# Altium schematic sheet 4_Configuration.SchDoc: FPGA Configuration
size Legal; Author: Praveen Perera; DrawnBy: Praveen Perera; Engineer: Praveen Perera; Revision: 0; SheetNumber: 4; SheetTotal: 9; Time: 12/26/2025
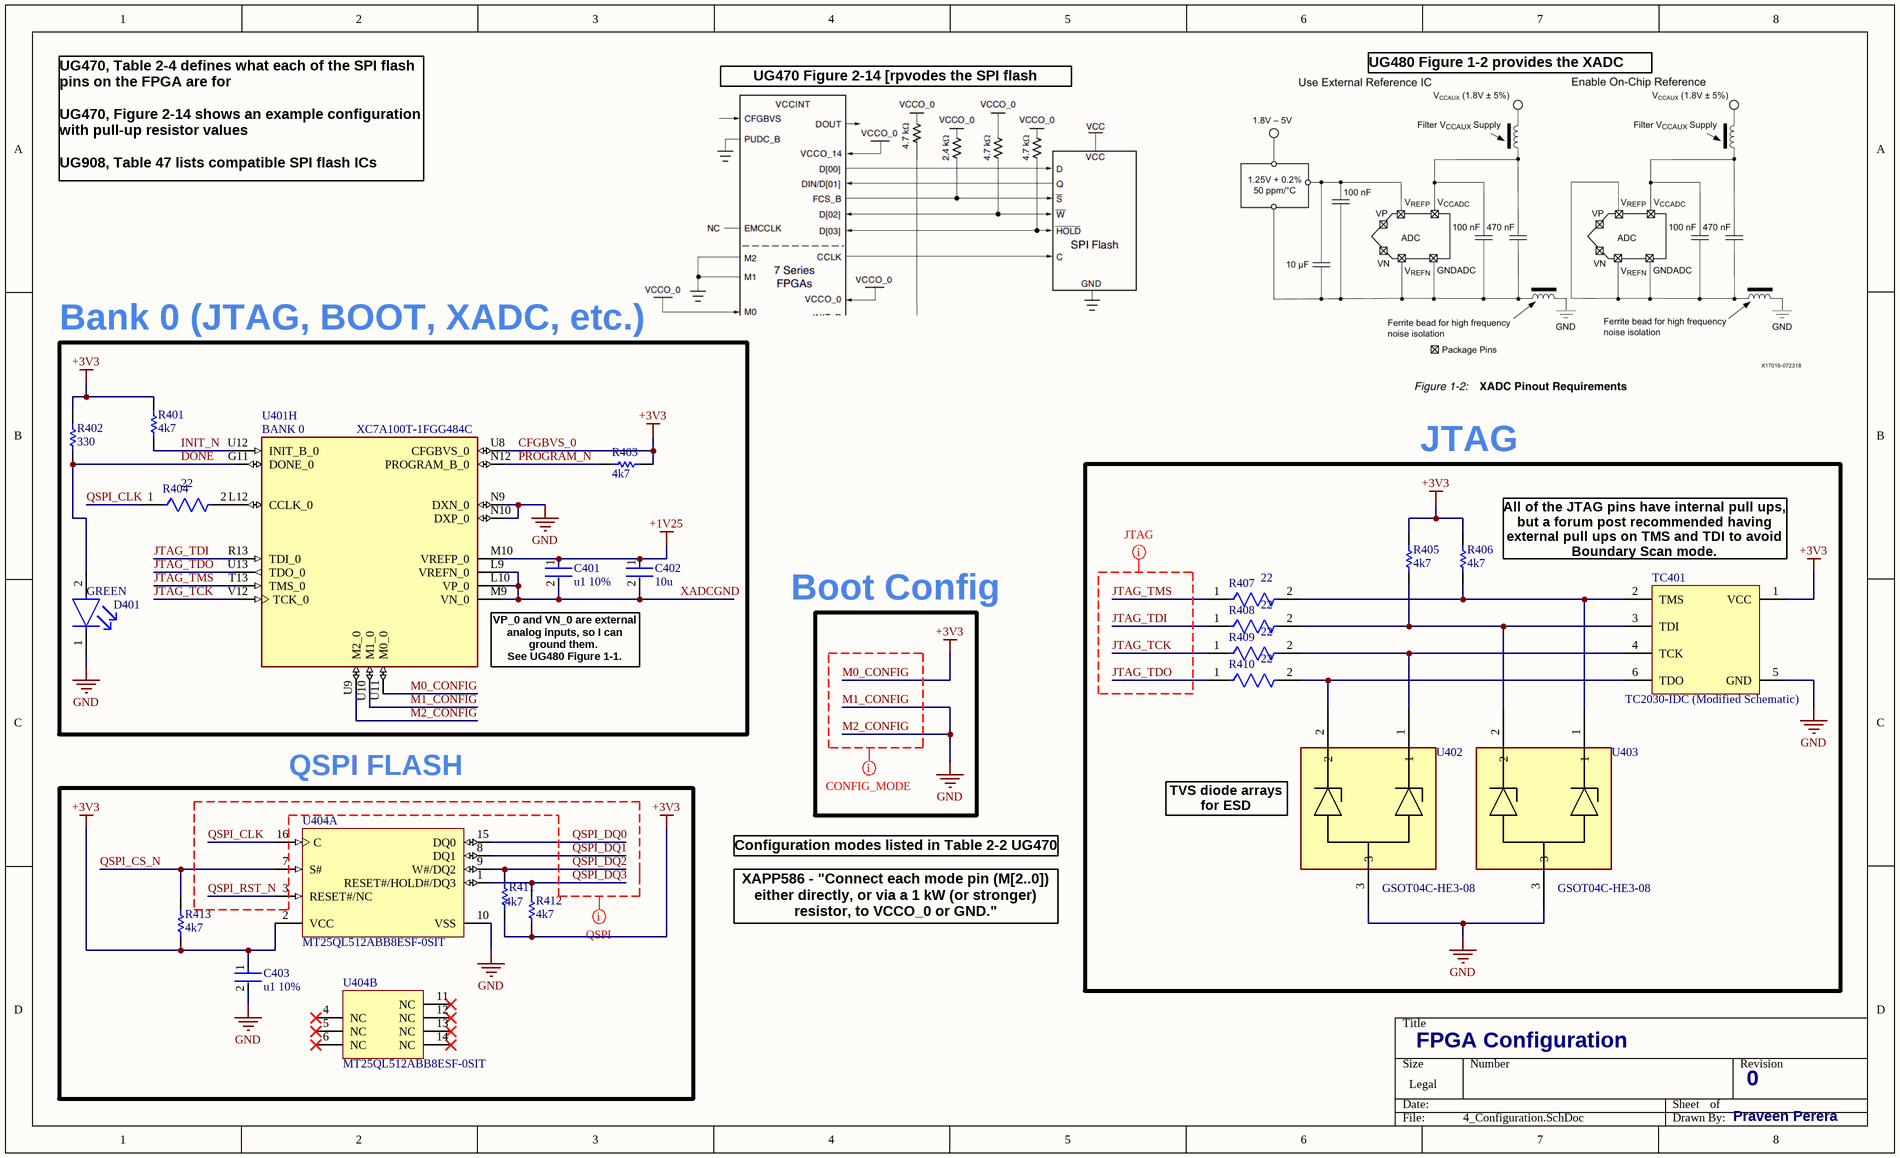
[diagram p0: 4_Configuration.SchDoc]

## Parts
C401  u1 10%  [FP-CL891-IPC_C]
C402  10u  [FP-CL05A106MP5NUNC-MFG]
C403  u1 10%  [FP-CL891-IPC_C]
D401  GREEN  [FP-SML-D12-MFG]
R401  4k7  [RESC0603X28X15NL05T05]
R402  330  [RESC0201(0603)_M]
R403  4k7  [RESC0603X28X15NL05T05]
R404  22  [FP-RMCF0201-IPC_C]
R405  4k7  [RESC0603X28X15NL05T05]
R406  4k7  [RESC0603X28X15NL05T05]
R407  22  [FP-RMCF0201-IPC_C]
R408  22  [FP-RMCF0201-IPC_C]
R409  22  [FP-RMCF0201-IPC_C]
R410  22  [FP-RMCF0201-IPC_C]
R411  4k7  [RESC0603X28X15NL05T05]
R412  4k7  [RESC0603X28X15NL05T05]
R413  4k7  [RESC0603X28X15NL05T05]
TC401  TC2030-IDC (Modified Schematic)  [*TC2030-IDC]
U401  XC7A100T-1FGG484C  [BGA484C100P22X22_2300X2300X260N]  (part H of 14)
U402  GSOT04C-HE3-08  [SOT_C-HE3-08_VIS]
U403  GSOT04C-HE3-08  [SOT_C-HE3-08_VIS]
U404  MT25QL512ABB8ESF-0SIT  [MICT-SF-16_L]  (parts A,B of 2)

## Nets
+1V25: C401.1 C402.1 U401.M10(VREFP_0)
CFGBVS_0: C403.1 R401.2 R402.1 R403.1 R405.2 R406.2 R411.1 R412.1 R413.1 TC401.1(VCC) U401.U8(CFGBVS_0) U401.U11(M0_0) U404.2(VCC)  [also labelled +3V3, M0_CONFIG]
M1_CONFIG: C403.2 D401.1(C) TC401.5(GND) U401.N9(DXN_0) U401.N10(DXP_0) U401.U9(M2_0) U401.U10(M1_0) U402.3 U403.3 U404.10(VSS)  [also labelled GND, M2_CONFIG]
DONE: D401.2(A) R402.2 U401.G11(DONE_0)
INIT_N: R401.1 U401.U12(INIT_B_0)
JTAG_TCK: R409.1 U401.V12(TCK_0)
JTAG_TDI: R408.1 U401.R13(TDI_0)
JTAG_TDO: R410.1 U401.U13(TDO_0)
JTAG_TMS: R407.1 U401.T13(TMS_0)
PROGRAM_N: R403.2 U401.N12(PROGRAM_B_0)
QSPI_CLK: R404.1 U404.16(C)
QSPI_CS_N: R413.2 U404.7(S#)
QSPI_DQ0: U404.15(DQ0)
QSPI_DQ1: U404.8(DQ1)
QSPI_DQ2: R411.2 U404.9(W#/DQ2)
QSPI_DQ3: R412.2 U404.1(RESET#/HOLD#/DQ3)
QSPI_RST_N: U404.3(RESET#/NC)
XADCGND: C401.2 C402.2 U401.L9(VREFN_0) U401.L10(VP_0) U401.M9(VN_0)
NetR404_2: R404.2 U401.L12(CCLK_0)
NetR405_1: R405.1 R408.2 TC401.3(TDI) U403.2
NetR406_1: R406.1 R407.2 TC401.2(TMS) U403.1
NetR409_2: R409.2 TC401.4(TCK) U402.1
NetR410_2: R410.2 TC401.6(TDO) U402.2

Not connected (* = marked no-connect by the designer): U404 4(NC)* 5(NC)* 6(NC)* 11(NC)* 12(NC)* 13(NC)* 14(NC)*

## Layout directives
mark named QSPI: QSPI_CLK, QSPI_DQ0, QSPI_DQ1, QSPI_DQ2, QSPI_DQ3, QSPI_RST_N
mark named CONFIG_MODE: M0_CONFIG, M1_CONFIG, M2_CONFIG
mark named JTAG: JTAG_TCK, JTAG_TDI, JTAG_TDO, JTAG_TMS

## Notes on the sheet
- UG470 Figure 2-14 [rpvodes the SPI flash configuration
- UG480 Figure 1-2 provides the XADC pinout
- UG470, Table 2-4 defines what each of the SPI flash pins on the FPGA are for
  UG470, Figure 2-14 shows an example configuration with pull-up resistor values
  UG908, Table 47 lists compatible SPI flash ICs
- Bank 0 (JTAG, BOOT, XADC, etc.)
- JTAG
- All of the JTAG pins have internal pull ups, but a forum post recommended having external pull ups on TMS and TDI to avoid Boundary Scan mode.
- Boot Config
- (near U401) VP_0 and VN_0 are external analog inputs, so I can ground them.
  See UG480 Figure 1-1.
- QSPI FLASH
- (near U402) TVS diode arrays for ESD protection
- Configuration modes listed in Table 2-2 UG470
- XAPP586 - "Connect each mode pin (M[2..0]) either directly, or via a 1 kW (or stronger) resistor, to VCCO_0 or GND."
- (in symbol XC7A100T-1FGG484C, part H) BANK 0

## Library data of the parts
C401 C403 = CMP-13271-001945-1: CL05B104KB5NNNC / Cap Ceramic 100nF 50V X7R ±10% SMD 0402 +125°C Paper T/R
C402 = CMP-13271-000002-1: CL05A106MP5NUNC / CAP CER 10UF 10V X5R 0402; Manufacturer: Samsung; Temperature Coefficient: 15%; Tolerance: 20%; Material: Ceramic; Octopart: https://octopart.com/cl05a106mp5nunc-samsung-22457395; Voltage Rating: 10V; RoHS: TRUE; Value: 10uF; Height: 0.7mm; Digikey Description: CAP CER 10UF 10V X5R 0402; Automotive: No; Package: CL05A106MP5NUNC; Device Class L1: Passive Components; Capacitance: 10uF; Temperature Range High: +85°C; ComponentLink2Description: Datasheet; Device Class L2: Capacitors; Temperature Characteristic: X5R; Manufacturer Part Number: CL05A106MP5NUNC; Temperature: -55°C to +85°C; ComponentLink2URL: http://www.samsungsem.com/kr/support/product-search/mlcc/__icsFiles/afieldfile/2019/05/10/19-CL05A106MP5NUNC.pdf; Device Class L3: Ceramic Capacitors; Category: Cap; Temperature Range Low: -55°C; Ipc Land Pattern Name: CAPC10050X50; Lead Free: Yes
D401 = CMP-08952-000005-1: SML-D12M1WT86 / LED YLW/GREEN DIFFUSED 1608 SMD; Manufacturer: Rohm; Led Orientation: Top View; Forward Voltage: 2.2V; Power Dissipation: 54mW; Wavelength: 572nm; Reverse Voltage: 5V; Forward Current: 20mA; Luminous Intensity: 30mcd; Manufacturer Part Number: SML-D12M1WT86; RoHS: TRUE; Package: SML-D12; Temperature Range Low: -40°C; Device Class L3: unset; Temperature Range High: +85°C; Device Class L2: LEDs; Category: Diode; Device Class L1: Optoelectronics; Digikey Description: LED YLW/GREEN DIFFUSED 1608 SMD; Temperature: -40°C to +85°C; ComponentLink2Description: Datasheet; Colour: Green; Automotive: No; Height: 0.65mm; Lead Free: Yes; Octopart: https://octopart.com/sml-d12m1wt86-rohm-70837112; ComponentLink2URL: https://www.rohm.com/datasheet/SML-D12M1W
R401 R403 R405 R406 R411-R413 = CMP-2004-00672-1: CRCW02014K70FNED; Manufacturer: Vishay Dale; Part Number: CRCW02014K70FNED
R402 = CMP-1010-00062-1: 330R 0.05W 5% 0201 (0603 Metric)  SMD; Case-EIA: 0201; Value: 330.00 Ohm; Case-Metric: 0603; Tolerance: 5 %; Technology: SMT; Power: 0.05 W
R404 R407-R410 = CMP-26527-003623-1: RMCF0201JG22R0 / 22Ω ±5% 0.05W 0201 Thick Film Chip Resistor AEC-Q200 compliant; Max Power Dissipation: 50mW; Resistance: 22R; Temperature Coefficient: 200ppm/°C; Length: 0.024inch; Height: 0.009inch; Max Operating Temperature: 125°C; Packaging: Tape and Reel; Number of Terminations: 2; Case/Package: 0201; Resistor Type: Thick Film; Width: 0.012inch; Case Code (Metric): 0603; Min Operating Temperature: -55°C; Case Code (Imperial): 0201; Tolerance: 5%
TC401 = CMP-022-000000-2: PLUG-OF-NAILS 6-PIN W/ LEGS 8; MF: Tag-Connect LLC; MP: TC2030-IDC; Component Type: Standard; Source: TC2030-IDC Modified.SchLib; Pin Count: 6; Value: *; SnapEDA_Link: https://www.snapeda.com/parts/TC2030-IDC/Tag-Connect/view-part/?ref=snap; Package: None; Design Item ID: TC2030-IDC; Check_prices: https://www.snapeda.com/parts/TC2030-IDC/Tag-Connect/view-part/?ref=eda
U401 = XC7A100T-1FGG484C: Artix-7 Field Programmable Gate Array (FPGA) IC 285 4976640 101440 484-BBGA; MF: Xilinx Inc.; Value: *; Check_prices: https://www.snapeda.com/parts/XC7A100T-1FGG484C/Xilinx/view-part/?ref=eda; MP: XC7A100T-1FGG484C; SnapEDA_Link: https://www.snapeda.com/parts/XC7A100T-1FGG484C/Xilinx/view-part/?ref=snap; Package: FBGA-484 Xilinx
U402 U403 = GSOT04C-HE3-08: ESD PROTECTION DIODE SOT23; Manufacturer_Name: Vishay; Type: Type; Datasheet: https://www.vishay.com/doc?85824; Manufacturer_Part_Number: GSOT04C-HE3-08; Copyright: Copyright (C) 2025 Ultra Librarian. All rights reserved.; RefDes: RefDes
U404 = CMP-2000-07603-1: Micron Serial NOR Flash Memory, 512 Mbits, 2.7 to 3.6 V, -40 to 85 degC, 16-Pin SOP2 (SF), RoHS; Operating Supply Voltage: 3V; Min Supply Voltage: 2.7V; Page Size: 256B; Access Time: 6ns; Max Supply Voltage: 3.6V; Frequency: 133MHz; Density: 512Mb; Datasheet URL: https://www.micron.com/~/media/documents/products/data-sheet/nor-flash/serial-nor/mt25q/die-rev-b/mt25q_qlkt_l_512_abb_0.pdf; Mounting Technology: SurfaceMount; Min Operating Temperature: -40degC; Package Reference: SF-16; Mount: SurfaceMount; Package Description: 16-Pin Small Outline Integrated Circuit Wide, Body 7.5 X 10.3 mm, Pitch 1.27 mm; Interface: Serial; Memory Type: FLASH; Datasheet Version: Rev. E, 06/2017; Manufacturer URL: http://www.micron.com/; RoHSCompliant: True; Manufacturer: Micron; Max Operating Temperature: 85degC